# Altium schematic sheet Magnetic-Encoder-V01.SchDoc
size A4; CompanyName: -; DrawnBy: Selim BERİŞ; Revision: V01; SheetNumber: 1; SheetTotal: 1; Project Name: Magnetic Encoder
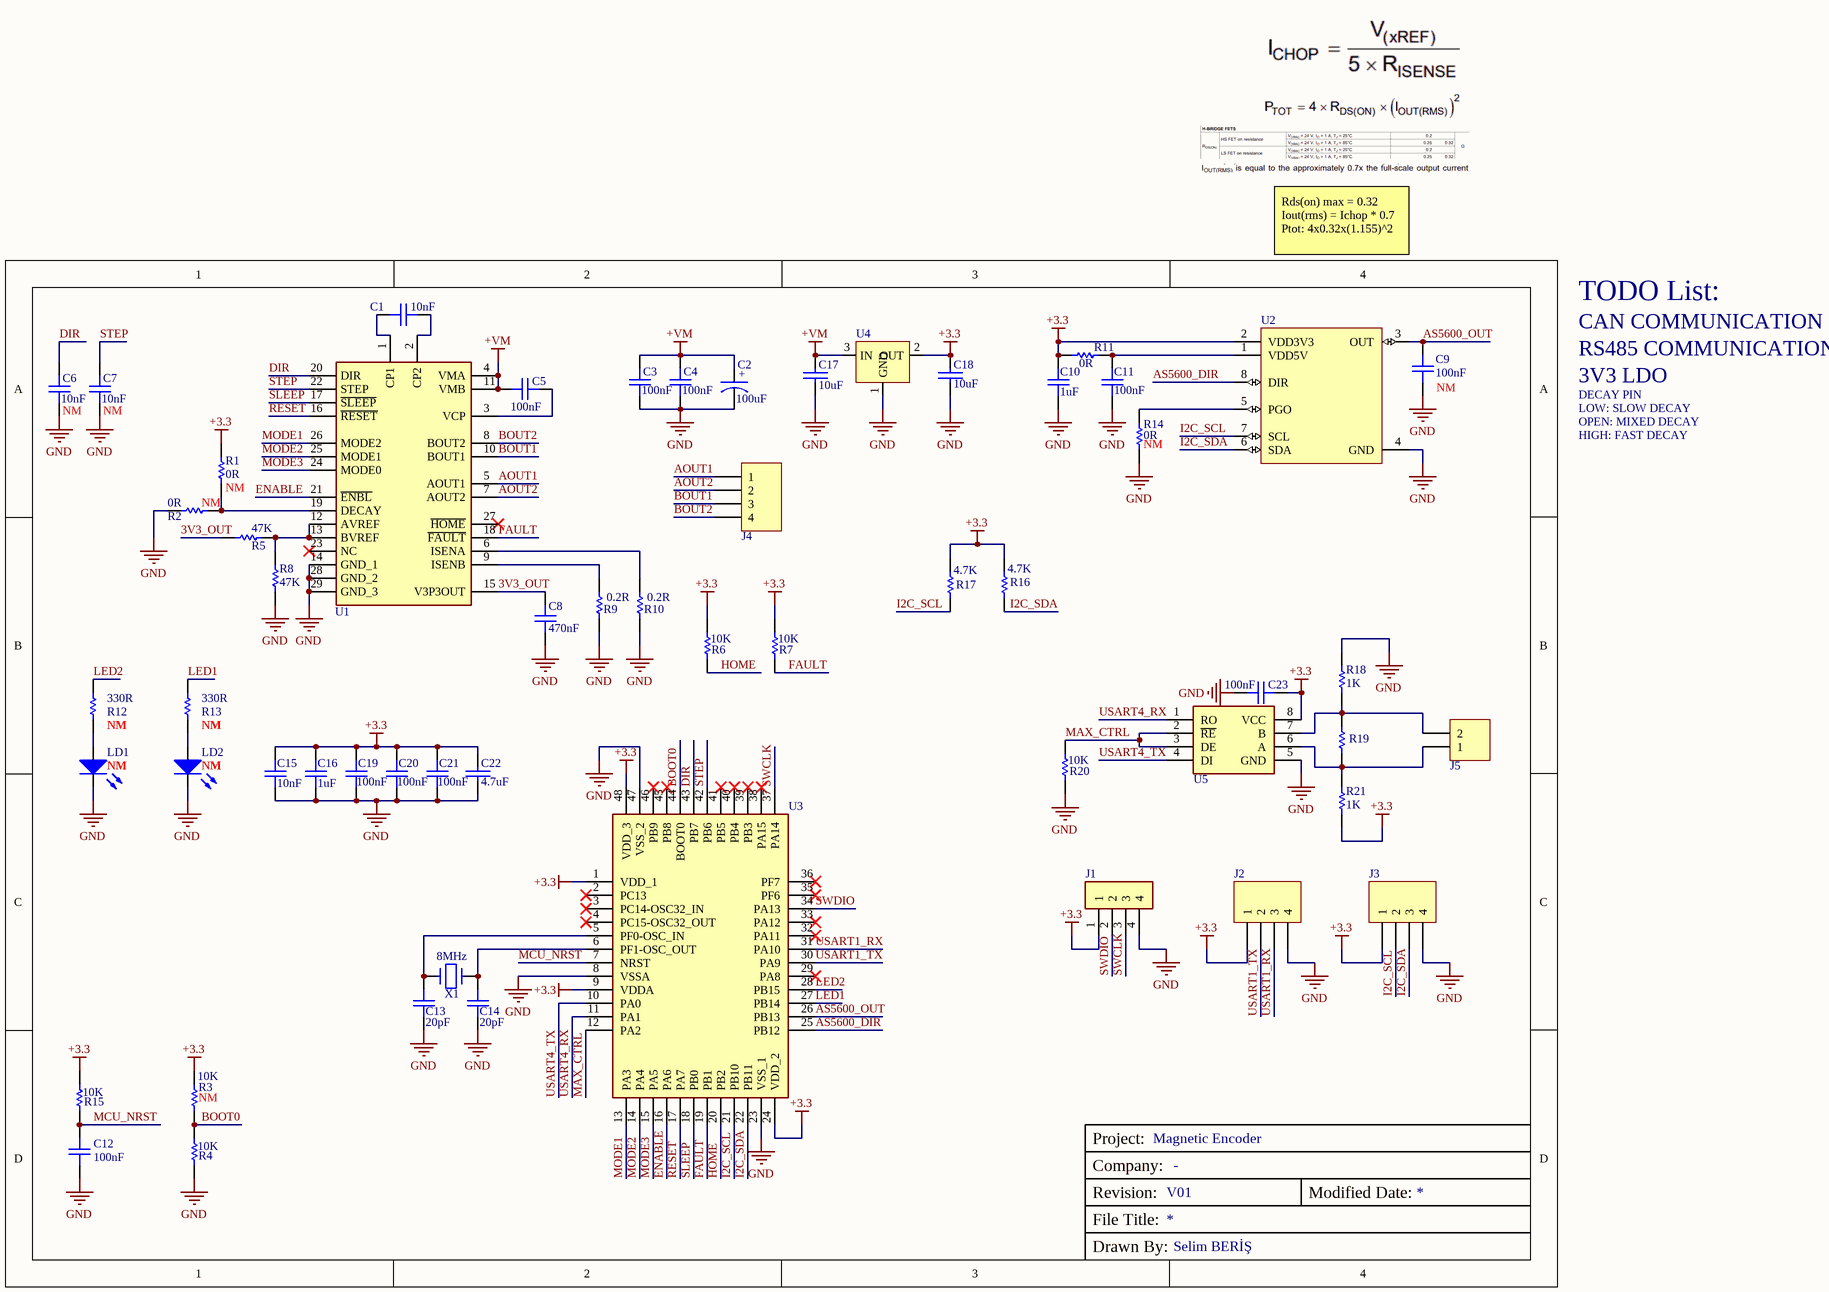
[diagram p0: Magnetic-Encoder-V01.SchDoc]

## Parts
C1  value 10nF  [Cap-0603]  (hidden comment: Capacitor)
C2  value 100uF  [MRW-025V101ME077-T/R]  (hidden comment: Capacitor)
C3  value 100nF  [Cap-0603]  (hidden comment: Capacitor)
C4  value 100nF  [Cap-0603]  (hidden comment: Capacitor)
C5  value 100nF  [Cap-0603]  (hidden comment: Capacitor)
C6  value 10nF  Process: NM  [Cap-0603]  (hidden comment: Capacitor)
C7  value 10nF  Process: NM  [Cap-0603]  (hidden comment: Capacitor)
C8  value 470nF  [Cap-0603]  (hidden comment: Capacitor)
C9  value 100nF  Process: NM  [Cap-0603]  (hidden comment: Capacitor)
C10  value 1uF  [Cap-0603]  (hidden comment: Capacitor)
C11  value 100nF  [Cap-0603]  (hidden comment: Capacitor)
C12  value 100nF  [Cap-0603]  (hidden comment: Capacitor)
C13  value 20pF  [Cap-0603]  (hidden comment: Capacitor)
C14  value 20pF  [Cap-0603]  (hidden comment: Capacitor)
C15  value 10nF  [Cap-0603]  (hidden comment: Capacitor)
C16  value 1uF  [Cap-0603]  (hidden comment: Capacitor)
C17  value 10uF  [Cap-0805]  (hidden comment: Capacitor)
C18  value 10uF  [Cap-0805]  (hidden comment: Capacitor)
C19  value 100nF  [Cap-0603]  (hidden comment: Capacitor)
C20  value 100nF  [Cap-0603]  (hidden comment: Capacitor)
C21  value 100nF  [Cap-0603]  (hidden comment: Capacitor)
C22  value 4.7uF  [Cap-0805]  (hidden comment: Capacitor)
C23  value 100nF  [Cap-0603]  (hidden comment: Capacitor)
J1  Header  [Header(M)_4PIN_2.54MM]  (value not drawn)
J2  Connector  [Connector_4_PIN_2.5MM]  (value not drawn)
J3  Connector  [Connector_4_PIN_2.5MM]  (value not drawn)
J4  Connector  [Connector_4_PIN_2.5MM]  (value not drawn)
J5  Klemens  [DG1285002P14]  (value not drawn)
LD1  Process: NM  [LED_0603]  (hidden comment: LED)
LD2  Process: NM  [LED_0603]  (hidden comment: LED)
R1  value 0R  Process: NM  [RES-0603]  (hidden comment: Resistor)
R2  value 0R  Process: NM  [RES-0603]  (hidden comment: Resistor)
R3  value 10K  Process: NM  [RES-0603]  (hidden comment: Resistor)
R4  value 10K  [RES-0603]  (hidden comment: Resistor)
R5  value 47K  [RES-0603]  (hidden comment: Resistor)
R6  value 10K  [RES-0603]  (hidden comment: Resistor)
R7  value 10K  [RES-0603]  (hidden comment: Resistor)
R8  value 47K  [RES-0603]  (hidden comment: Resistor)
R9  value 0.2R  [RES-0603]  (hidden comment: Resistor)
R10  value 0.2R  [RES-0603]  (hidden comment: Resistor)
R11  value 0R  [RES-0603]  (hidden comment: Resistor)
R12  value 330R  Process: NM  [RES-0603]  (hidden comment: Resistor)
R13  value 330R  Process: NM  [RES-0603]  (hidden comment: Resistor)
R14  value 0R  Process: NM  [RES-0603]  (hidden comment: Resistor)
R15  value 10K  [RES-0603]  (hidden comment: Resistor)
R16  value 4.7K  [RES-0603]  (hidden comment: Resistor)
R17  value 4.7K  [RES-0603]  (hidden comment: Resistor)
R18  value 1K  [Resistor_0603]  (hidden comment: Resistor)
R19  Resistor  [RES-0603]  (value not drawn)
R20  value 10K  [RES-0603]  (hidden comment: Resistor)
R21  value 1K  [Resistor_0603]  (hidden comment: Resistor)
U1  Motor Driver  [HTSSOP-28]  (value not drawn)
U2  Magnetic Encoder  [SOIC 8]  (value not drawn)
U3  Microcontroller  [LQFP-48]  (value not drawn)
U4  Voltage Regulator  [SOT223-3]  (value not drawn)
U5  Transceiver  [SOIC 8]  (value not drawn)
X1  Frequency: 8MHz  [HC-49SD]  (hidden comment: Crystal)

## Nets
+3.3: C10.2 C15.2 C16.2 C18.1 C19.2 C20.2 C21.2 C22.1 C23.1 J1.1 J2.1 J3.1 R1.1 R3.2 R6.1 R7.1 R11.2 R15.2 R16.2 R17.2 R21.2 U2.2(VDD3V3) U3.1(VDD_1) U3.9(VDDA) U3.24(VDD_2) U3.48(VDD_3) U4.2(OUT) U5.8(VCC)
+VM: C2.1 C3.1 C4.1 C5.1 C17.1 U1.4(VMA) U1.11(VMB) U4.3(IN)
GND: C2.2 C3.2 C4.2 C6.2 C7.1 C8.2 C9.1 C10.1 C11.1 C12.2 C13.2 C14.2 C15.1 C16.1 C17.2 C18.2 C19.1 C20.1 C21.1 C22.2 C23.2 J1.4 J2.4 J3.4 LD1.2 LD2.2 R2.2 R4.1 R8.2 R9.1 R10.1 R14.1 R18.1 R20.2 U1.14(GND_1) U1.28(GND_2) U1.29(GND_3) U2.4(GND) U3.8(VSSA) U3.23(VSS_1) U3.47(VSS_2) U4.1(GND) U5.5(GND)
3V3_OUT: C8.1 R5.2 U1.15(V3P3OUT)
AOUT1: J4.1 U1.5(AOUT1)
AOUT2: J4.2 U1.7(AOUT2)
AS5600_DIR: U2.8(DIR) U3.25(PB12)
AS5600_OUT: C9.2 U2.3(OUT) U3.26(PB13)
BOOT0: R3.1 R4.2 U3.44(BOOT0)
BOUT1: J4.3 U1.10(BOUT1)
BOUT2: J4.4 U1.8(BOUT2)
DIR: C6.1 U1.20(DIR) U3.43(PB7)
ENABLE: U1.21(~{ENBL}) U3.16(PA6)
FAULT: R7.2 U1.18(~{FAULT}) U3.19(PB1)
HOME: R6.2 U3.20(PB2)
I2C_SCL: J3.2 R17.1 U2.7(SCL) U3.21(PB10)
I2C_SDA: J3.3 R16.1 U2.6(SDA) U3.22(PB11)
LED1: R13.2 U3.27(PB14)
LED2: R12.2 U3.28(PB15)
MAX_CTRL: R20.1 U3.12(PA2) U5.2(~{RE}) U5.3(DE)
MCU_NRST: C12.1 R15.1 U3.7(NRST)
MODE1: U1.26(MODE2) U3.13(PA3)
MODE2: U1.25(MODE1) U3.14(PA4)
MODE3: U1.24(MODE0) U3.15(PA5)
RESET: U1.16(~{RESET}) U3.17(PA7)
SLEEP: U1.17(~{SLEEP}) U3.18(PB0)
STEP: C7.2 U1.22(STEP) U3.42(PB6)
SWCLK: J1.3 U3.37(PA14)
SWDIO: J1.2 U3.34(PA13)
USART1_RX: J2.3 U3.31(PA10)
USART1_TX: J2.2 U3.30(PA9)
USART4_RX: U3.11(PA1) U5.1(RO)
USART4_TX: U3.10(PA0) U5.4(DI)
NetC1_1: C1.1 U1.1(CP1)
NetC1_2: C1.2 U1.2(CP2)
NetC5_2: C5.2 U1.3(VCP)
NetC11_2: C11.2 R11.1 U2.1(VDD5V)
NetC13_1: C13.1 U3.5(PF0-OSC_IN) X1.1
NetC14_1: C14.1 U3.6(PF1-OSC_OUT) X1.2
NetJ5_1: J5.1 R19.2 R21.1 U5.6(A)
NetJ5_2: J5.2 R18.2 R19.1 U5.7(B)
NetLD1_1: LD1.1 R12.1
NetLD2_1: LD2.1 R13.1
NetR1_2: R1.2 R2.1 U1.19(DECAY)
NetR5_1: R5.1 R8.1 U1.12(AVREF) U1.13(BVREF)
NetR9_2: R9.2 U1.9(ISENB)
NetR10_2: R10.2 U1.6(ISENA)
NetR14_2: R14.2 U2.5(PGO)

Not connected (* = marked no-connect by the designer): U1 23(NC)* 27(~{HOME})*; U3 2(PC13)* 3(PC14-OSC32_IN)* 4(PC15-OSC32_OUT)* 29(PA8)* 32(PA11)* 33(PA12)* 35(PF6)* 36(PF7)* 38(PA15)* 39(PB3)* 40(PB4)* 41(PB5)* 45(PB8)* 46(PB9)*

## Notes on the sheet
- Rds(on) max = 0.32
  Iout(rms) = Ichop * 0.7
  Ptot: 4x0.32x(1.155)^2
- CAN COMMUNICATION
- RS485 COMMUNICATION
- TODO List:
- 3V3 LDO
- DECAY PIN
- LOW: SLOW DECAY
- OPEN: MIXED DECAY
- HIGH: FAST DECAY
- Company:
- Project:
- Drawn By:
- File Title:
- Revision:
- Modified Date:
- (in symbol MRW-025V101ME077-T/R) +

## Library data of the parts
C1 C15 = Capacitor_0603: MLCC (1608) 0603 10nF 50VDC ±10% X7R; Part Number: CC0603KRX7R9BB103; Voltage: 50V; Tolerance: %10; Process: SMD
C2 = MRW-025V101ME077-T/R: CAP.EL.100uF 25V 6.3x7.7 105C 2000Hrs SMD; Tolerance: %20; Voltage: 25V; Part Number: MRW-025V101ME077-T/R; Process: SMD
C3-C5 C11 C12 C19-C21 C23 = Capacitor_0603: MLCC (1608) 0603 100nF 50VDC ±10% X7R; Part Number: MCF03KTB500104; Voltage: 50V; Tolerance: %10; Process: SMD
C6 C7 = Capacitor_0603: MLCC (1608) 0603 10nF 50VDC ±10% X7R; Part Number: CC0603KRX7R9BB103; Voltage: 50V; Tolerance: %10
C8 = Capacitor_0603: MLCC (1608) 0603 470nF 25VDC ±10% X7R; Part Number: CL10B474KA8NNNC; Voltage: 25V; Tolerance: %10; Process: SMD
C9 = Capacitor_0603: MLCC (1608) 0603 100nF 50VDC ±10% X7R; Part Number: MCF03KTB500104; Voltage: 50V; Tolerance: %10
C10 C16 = Capacitor_0603: MLCC (1608) 0603 1uF 25VDC ±10% X7R; Part Number: CL10B105KA8NNNC; Voltage: 25V; Tolerance: %10; Process: SMD
C13 C14 = Capacitor_0603: MLCC (1608) 0603 20pF 50VDC ±5% C0G (NP0); Part Number: CC0603JRNPO9BN200; Voltage: 50V; Tolerance: %10; Process: SMD
C17 C18 = Capacitor_0805: MLCC (2012) 0805 10uF 25VDC ±10% X5R; Part Number: CL21A106KAYNNNE; Tolerance: %10; Voltage: 25V; Process: SMD
C22 = Capacitor_0805: MLCC (2012) 0805 4.7uF 25VDC ±10% X5R; Part Number: CL21A475KAQNNNE; Tolerance: %10; Voltage: 25V; Process: SMD
J1 = Header(M)_4PIN_2.54MM: Header 4-Pin Male 2.54mm Pitch; Process: THT; Part Number: *
J2-J4 = 353120460: Connector Header Through Hole 4 position 0.098" (2.50mm); Process: SMD; Part Number: 353120460
J5 = Klemens_2PIN_VIDA: TERM.BLK.5.00MM 2P PCB TYPE 1 BOY GREEN; Part Number: DG128-5.0-02P-14-00AH; Process: THT
LD1 LD2 = LED_0603: LED - Discrete 0603 (1608 Metric); Part Number: LTST-C190KRKT; Color: RED; Forward Voltage: 2V
R1 R2 R14 = Resistor_0603: RES.(1608) 0603 0 Ohms 5% 1/10W-S; Part Number: CRT03J7-R0R0; Power: 1/10W; Tolerance: %5
R3 = Resistor_0603: RES.(1608) 0603 10K Ohms 5% 1/10W AUTOMOTIV; Part Number: CQ03SAJ0103T5E; Tolerance: %5; Power: 1/10W
R4 R6 R7 R15 R20 = Resistor_0603: RES.(1608) 0603 10K Ohms 5% 1/10W AUTOMOTIV; Part Number: CQ03SAJ0103T5E; Process: SMD; Tolerance: %5; Power: 1/10W
R5 R8 = Resistor_0603: RES.(1608) 0603 47K Ohms 5% 1/10W-S; Part Number: 0603SAJ0473TDE; Power: 1/10W; Tolerance: %5; Process: SMD
R9 R10 = Resistor_0603: RES.(1608) 0603 200m Ohms 1% 1/5W; Part Number: CQ03SAJ0103T5E; Process: SMD; Tolerance: %1; Power: 1/5W
R11 = Resistor_0603: RES.(1608) 0603 0 Ohms 5% 1/10W-S; Part Number: CRT03J7-R0R0; Power: 1/10W; Tolerance: %5; Process: SMD
R12 R13 = Resistor_0603: RES.(1608) 0603 330 Ohms 1% 1/10W AEC-Q200; Part Number: CRCW0603330RFKTABC; Tolerance: %1; Power: 1/10W
R16 R17 = Resistor_0603: RES.(1608) 0603 4.7K Ohms 1% 1/10W; Part Number: CRT03F7E4701; Tolerance: %5; Process: SMD; Power: 1/10W
R18 R21 = Resistor: RES.(1608) 0603 1K Ohms 5% 1/10W 100PPM SMT; Part Number: RC0603JR-071KL; Tolerance: %5; Process: SMD; Power: 1/10W
R19 = Resistor_0603: RES.(1608) 0603 120 Ohms 1% 1/10W-S 100PPM; Part Number: 0603SAF1200T5E; Process: SMD; Tolerance: %1; Power: 1/10W; Value: 120R
U1 = DRV8825PWPR: Bipolar Motor Driver Power MOSFET Logic 28-HTSSOP; Process: SMD; Part Number: DRV8825PWPR
U2 = AS5600: Hall Effect Sensor Angle External Magnet, Not Included Gull Wing; Process: SMD; Part Number: AS5600
U3 = STM32F030C8T6: 32-Bit MCU Cortex-M0 64KB Flash LQFP48 STM32F030C8T6, 32 bit ARM Cortex M0 Microcontroller 48MHz 64 kB Flash, 8 kB RAM, I2C 48-Pin LQFP; Process: SMD; Part Number: STM32F030C8T6
U4 = AMS1117-3.3: IC-1117 V.REG. 1A 3V3 SOT223 SMD AMS; pin to pad: 2>2+4; Process: SMD; Part Number: AMS1117-3.3
U5 = MAX3485ED-HTC: IC-3485 TRANSCEIVER RS-485/RS-422 SOP-8; Process: SMD; Part Number: MAX3485ED-HTC
X1 = Crystal_SMD_2: CRYSTAL 8MHz HC49SMT 20pF SMD TR RALTRON; Part Number: AS-8.000-20-SMD-TR; Process: SMD; Capacitance: 20pF